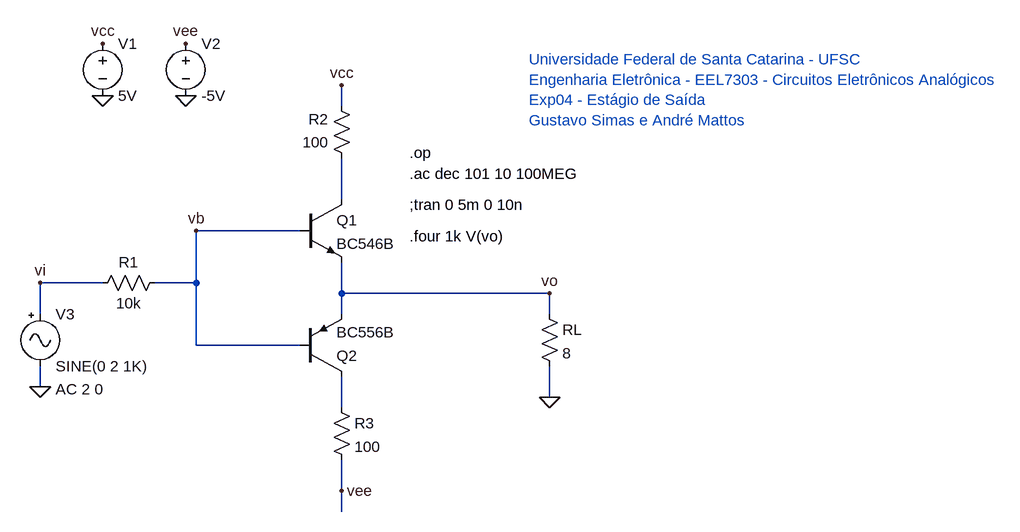
[diagram p0: schematic Lab04.asc]
Lab04.asc, the LTspice schematic file:
Version 4
SHEET 1 1288 680
WIRE 224 -64 224 -96
WIRE 224 80 224 16
WIRE 160 128 0 128
WIRE -144 208 -240 208
WIRE 0 208 0 128
WIRE 0 208 -64 208
WIRE 224 224 224 176
WIRE 544 224 224 224
WIRE -240 256 -240 208
WIRE 224 256 224 224
WIRE 544 256 544 224
WIRE 0 304 0 208
WIRE 160 304 0 304
WIRE -240 368 -240 336
WIRE 544 384 544 336
WIRE 224 400 224 352
WIRE 224 528 224 480
WIRE 224 560 224 528
FLAG -144 -80 0
FLAG -16 -80 0
FLAG -144 -160 vcc
FLAG -16 -160 vee
FLAG -240 368 0
FLAG 224 -96 vcc
FLAG 224 528 vee
FLAG 544 384 0
FLAG -240 208 vi
FLAG 0 128 vb
FLAG 544 224 vo
SYMBOL npn 160 80 R0
SYMATTR InstName Q1
SYMATTR Value BC546B
SYMBOL pnp 160 352 M180
SYMATTR InstName Q2
SYMATTR Value BC556B
SYMBOL res -48 192 R90
WINDOW 0 0 56 VBottom 2
WINDOW 3 32 56 VTop 2
SYMATTR InstName R1
SYMATTR Value 10k
SYMBOL res 240 32 R180
WINDOW 0 36 76 Left 2
WINDOW 3 36 40 Left 2
SYMATTR InstName R2
SYMATTR Value 100
SYMBOL voltage -144 -176 R0
WINDOW 123 0 0 Left 0
WINDOW 39 0 0 Left 0
SYMATTR InstName V1
SYMATTR Value 5V
SYMBOL voltage -16 -176 R0
WINDOW 123 0 0 Left 0
WINDOW 39 0 0 Left 0
SYMATTR InstName V2
SYMATTR Value -5V
SYMBOL Misc\\signal -240 240 R0
WINDOW 123 24 132 Left 2
WINDOW 39 0 0 Left 0
SYMATTR Value2 AC 2 0
SYMATTR InstName V3
SYMATTR Value SINE(0 2 1K)
SYMBOL res 528 240 R0
SYMATTR InstName RL
SYMATTR Value 8
SYMBOL res 208 384 R0
SYMATTR InstName R3
SYMATTR Value 100
TEXT 328 8 Left 2 !.op
TEXT 512 -136 Left 2 ;Universidade Federal de Santa Catarina - UFSC\nEngenharia Eletrônica - EEL7303 - Circuitos Eletrônicos Analógicos\nExp04 - Estágio de Saída\nGustavo Simas e André Mattos
TEXT 328 40 Left 2 !.ac dec 101 10 100MEG
TEXT 328 88 Left 2 !;tran 0 5m 0 10n
TEXT 328 136 Left 2 !.four 1k V(vo)

The netlist it stands for:
* Lab04.asc
Q1 N001 vb vo 0 BC546B
Q2 N002 vb vo 0 BC556B
R1 vb vi 10k
R2 N001 vcc 100
V1 vcc 0 5V
V2 vee 0 -5V
V3 vi 0 SINE(0 2 1K) AC 2 0
RL vo 0 8
R3 N002 vee 100
.model NPN NPN
.model PNP PNP
.lib standard.bjt
.op
* Universidade Federal de Santa Catarina - UFSC
* Engenharia Eletrônica - EEL7303 - Circuitos Eletrônicos Analógicos
* Exp04 - Estágio de Saída
* Gustavo Simas e André Mattos
.ac dec 101 10 100MEG
;tran 0 5m 0 10n
.four 1k V(vo)
.backanno
.end

* Results of the author's LTspice run, read from the files saved beside the schematic
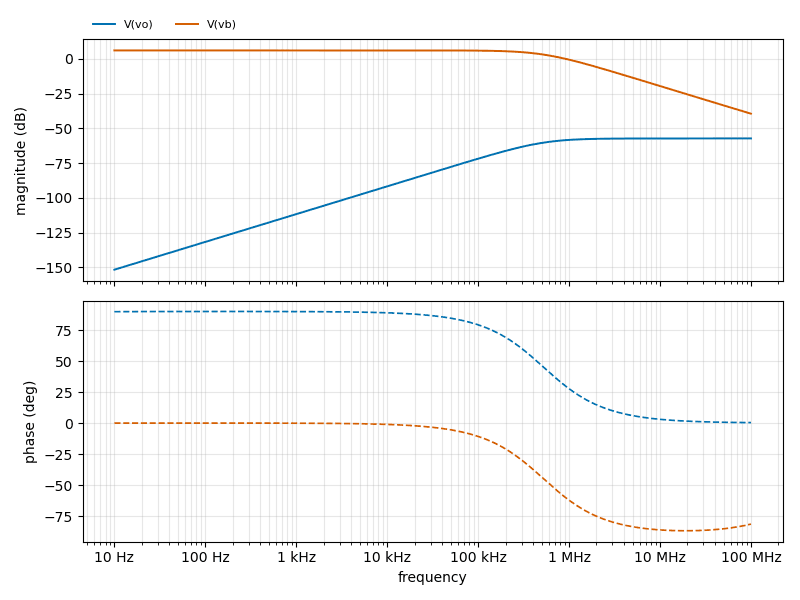
[diagram p1: AC Analysis of Lab04.asc, plotted from the saved traces]
* AC Analysis, 1 run:
*   V(vo): -151.69 dB at 10 Hz, -57.29 dB at 100 MHz, peak -57.29 dB at 100 MHz, 3 dB below the peak at 525 kHz
*   V(vb): 6.02 dB at 10 Hz, -39.49 dB at 100 MHz, peak 6.02 dB at 10 Hz, 3 dB below the peak at 524.7 kHz
* From the log:
*   Semiconductor Device Operating Points:
*                           --- Bipolar Transistors ---
*   Name:       q2          q1
*   Model:    bc556b      bc546b
*   Ib:       5.29e-12   -5.07e-12
*   Ic:      -5.33e-12    5.09e-12
*   Vbe:     -2.22e-09   -2.22e-09
*   Vbc:      5.00e+00   -5.00e+00
*   Vce:     -5.00e+00    5.00e+00
*   BetaDC:  -1.01e+00   -1.00e+00
*   Gm:       1.81e-12    9.88e-13
*   Rpi:      7.62e+11    9.16e+11
*   Rx:       1.00e+00    1.00e+00
*   Ro:       5.51e+14    2.64e+15
*   Cbe:      1.23e-11    1.36e-11
*   Cbc:      1.69e-12    1.07e-12
*   Cjs:      0.00e+00    0.00e+00
*   BetaAC:   1.38e+00    9.05e-01
*   Cbx:      9.95e-13    6.58e-13
*   Ft:       1.33e-02    4.84e-03
*   Note: .fourier statements are only valid with a .tran command.
*         No Fourier analysis performed.